# EAGLE schematic nubhub (EAGLE 8.0.0)
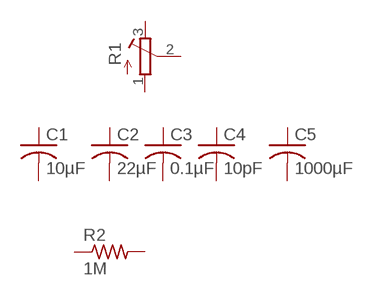
[diagram p0: schematic, sheet 1]

## Parts
C1  10µF  C-USC0805  [C0805]
C2  22µF  C-USC1206  [C1206]
C3  0.1µF  C-USC0402  [C0402]
C4  10pF  C-USC0603K  [C0603K]
C5  1000µF  C-US050-075X075  [C050-075X075]
R2  1M  R-US_R0402  [R0402]
U$1  TC33X-2-504E  [TC33]
Unconnected: C1.1 C1.2 C2.1 C2.2 C3.1 C3.2 C4.1 C4.2 C5.1 C5.2 R2.1 R2.2 U$1.1 U$1.2 U$1.3

## Library data of the parts
C1-C5 = resistor:C-US: CAPACITOR, American symbol
R2 = resistor:R-US_: RESISTOR, American symbol
U$1 = TC33X-2-504E:TC33X-2-504E